# EAGLE design 24V_LM317 (EAGLE 9.5.1)
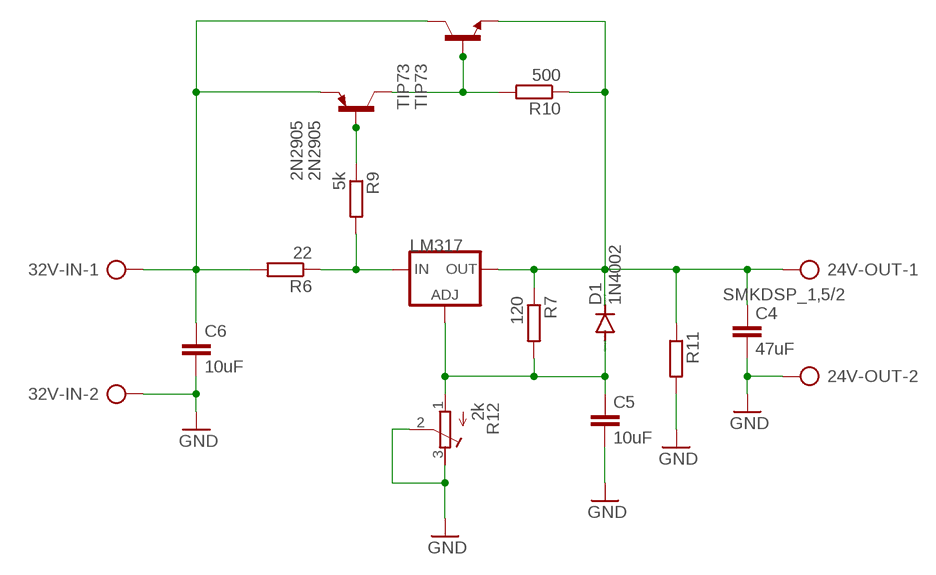
[diagram p0: schematic, sheet 1]

## Parts
2N2905  2N2905  [TO39]
24V-OUT  SMKDSP_1,5/2  [SMKDSP_1,5/2]
32V-IN  SMKDSP_1,5/2  [SMKDSP_1,5/2]
C4  47uF  C-EU025-025X050  [C025-025X050]
C5  10uF  C-EU025-025X050  [C025-025X050]
C6  10uF  C-EU025-025X050  [C025-025X050]
D1  1N4002  1N4004DO-41  [DIOAD860W70L460D235B]
LM317  LM317TS317TS_TO220  [TO220V]
R6  22  R-EU_0204/7  [0204/7]
R7  120  R-EU_0204/7  [0204/7]
R9  5k  R-EU_0204/7  [0204/7]
R10  500  R-EU_0204/7  [0204/7]
R11  R-EU_0204/7  [0204/7]
R12  2k  R-TRIMM64W  [RTRIM64W]
TIP73  TIP73  2N1613  [TO5]

## Nets
24V: 24V-OUT.1 C4.1 D1.1(C) LM317.2(OUT) R7.1 R10.1 R11.1 TIP73.1(E)
GND: 24V-OUT.2 32V-IN.2 C4.2 C5.2 C6.2 R11.2 R12.2(S) R12.3(E)
N$5: LM317.3(IN) R6.1 R9.2
N$6: 2N2905.2(B) R9.1
N$7: 2N2905.3(C) R10.2 TIP73.2(B)
N$8: 2N2905.1(E) 32V-IN.1 C6.1 R6.2 TIP73.3(C)
N$9: C5.1 D1.2(A) LM317.1(ADJ) R7.2 R12.1(A)

## Library data of the parts
2N2905 = transistor-pnp:2N2905*: PNP Transistror
24V-OUT 32V-IN = con-phoenix-smkdsp:SMKDSP_1,5/2: Printklemme, Nennstrom: 17,5 A, Bemessungsspannung: 250 V, Raster: 5,0 mm Source: http://eshop.phoenixcontact.de .. 1733415.pdf; MF: FARNELL; MPN: 1733570; OC_FARNELL: 3041244; OC_NEWARK: 69C8588
C4-C6 = rcl:C-EU: CAPACITOR, European symbol; SPICEPREFIX: C
D1 = diode_MOD:1N4004: DIODE general purpose rectifier, 1 A
LM317 = v-reg:LM317TS: VOLTAGE REGULATOR
R6 R7 R9-R11 = rcl:R-EU_: RESISTOR, European symbol; SPICEPREFIX: R
R12 = rcl:R-TRIMM: Trimm resistor; SPICEMODEL: X; SPICEPREFIXL: POT
TIP73 = transistor:2N1613: NPN TRANSISTOR

## Board
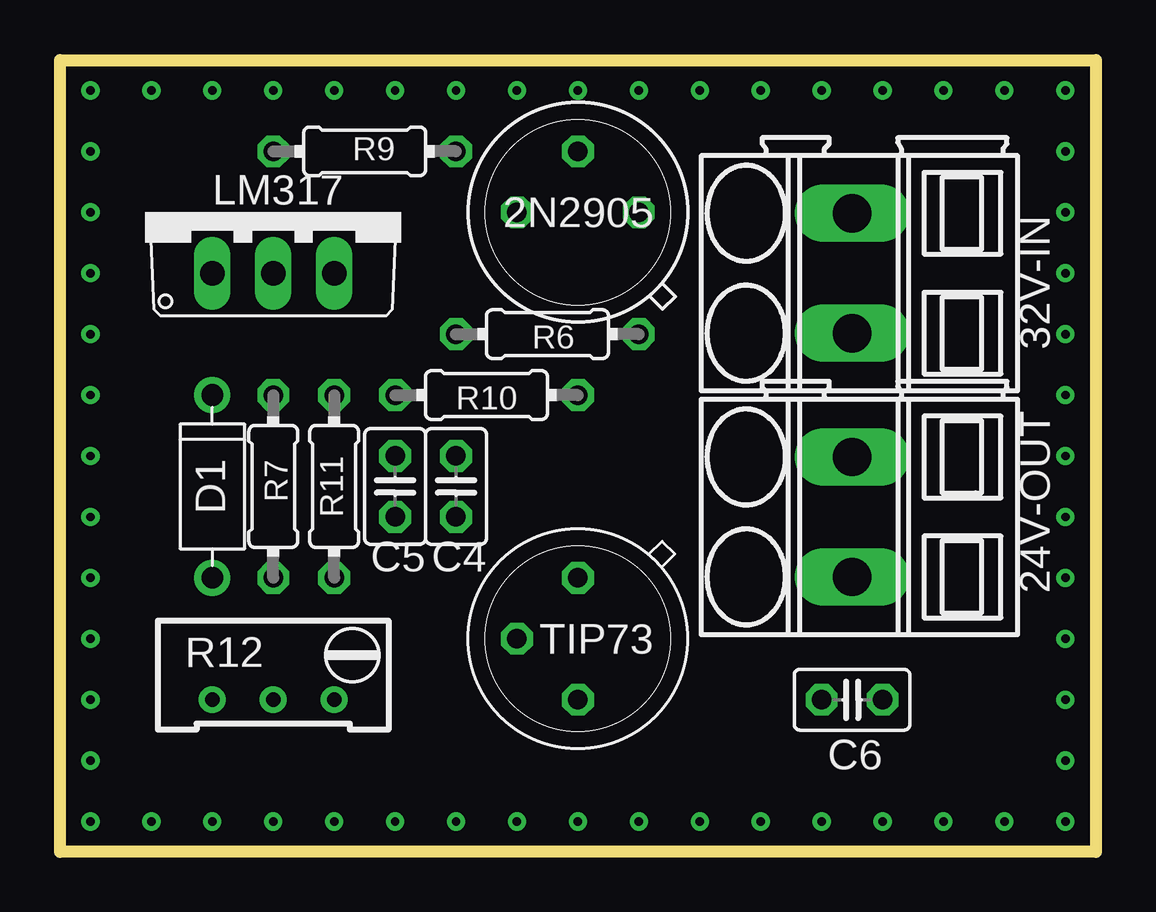
[diagram p1: board, top side]
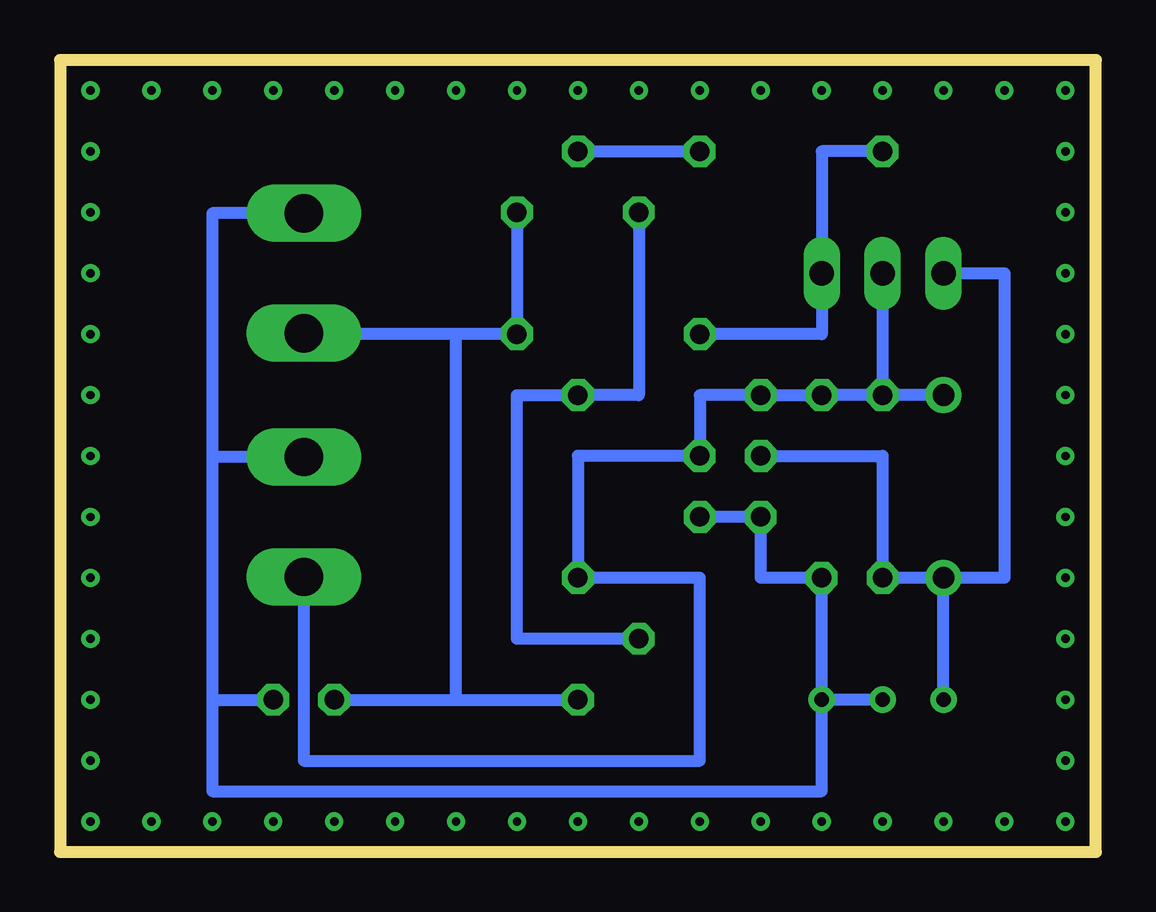
[diagram p2: board, bottom side, seen from below]

Size 43.18 x 33.02 mm. Coordinates in mm from the lower left corner, seen from the top.
Outline: 0,33.02 43.18,33.02 43.18,0 0,0 0,33.02
Copper layers (1*16): Top 0.035mm / dielectric 1.5mm / Bottom 0.035mm
Design rules "default": minimum track width 6mil, minimum drill 0.35mm, track to track 6mil, track to pad 6mil, pad to pad 6mil, via to via 6mil, smd to smd 6mil, copper to edge 40mil, drill to drill 6mil, minimum pad ring 10mil, minimum via ring 8mil, stop-mask expansion 4mil, vias tented up to drill 0mil, thermal gap 10mil

### Footprints (pad centres in the part's own frame; a part is rotated, then mirrored left to right if it is on the bottom)
TO39 = drill 0.813 octagon: 1 0,-2.54; 2 2.54,0; 3 0,2.54
SMKDSP_1,5/2 = drill 1.6 pad 1.8 long: 1 -2.5,0; 2 2.5,0
C025-025X050 = drill 0.813 octagon: 1 -1.27,0; 2 1.27,0
DIOAD860W70L460D235B = drill 0.9 pad 1.5: 1 -3.81,0; 2 3.81,0
TO220V = drill 1.016 long: 1 -2.54,-2.54; 2 0,-2.54; 3 2.54,-2.54
0204/7 = drill 0.813 octagon: 1 -3.81,0; 2 3.81,0
RTRIM64W = drill 0.61: 1 1.27,-2.54; 2 1.27,0; 3 1.27,2.54
TO5 = drill 0.813 octagon: 1 0,-2.54; 2 2.54,0; 3 0,2.54

### Placement (x,y rotation side)
2N2905  21.59,26.67 90 top
24V-OUT  33.02,13.97 90 top
32V-IN  33.02,24.13 90 top
C4  16.51,15.24 270 top
C5  13.97,15.24 270 top
C6  33.02,6.35 0 top
D1  6.35,15.24 270 top
LM317  8.89,26.67 0 top
R6  20.32,21.59 0 top
R7  8.89,15.24 270 top
R9  12.7,29.21 180 top
R10  17.78,19.05 0 top
R11  11.43,15.24 270 top
R12  8.89,7.62 270 top
TIP73  21.59,8.89 180 top

### Tracks (layer width: path | path; a pad name or v marks a point on that pad's centre or on a via)
24V
  Bottom 0.508: R7.1 R11.1 R10.1 16.51,19.05 C4.1 21.59,16.51 TIP73.1 16.51,11.43 16.51,3.81 33.02,3.81 24V-OUT.1 | LM317.2 R7.1 | D1.1 R7.1
GND
  Bottom 0.508: C4.2 C5.2 13.97,11.43 R11.2 R12.3 | R12.2 R12.3 | 32V-IN.2 36.83,26.63 36.83,16.47 | 24V-OUT.2 36.83,16.47 | 36.83,16.47 36.83,6.35 | 36.83,6.35 C6.2 | 36.83,6.35 36.83,2.54 11.43,2.54 R12.3
N$1  (via drill 0.35)
  other vias: 1.27,24.13
N$2  (via drill 0.35)
  other vias: 1.27,26.67
N$3  (via drill 0.35)
  other vias: 1.27,29.21
N$4  (via drill 0.35)
  other vias: 1.27,31.75
N$5
  Bottom 0.508: R9.2 11.43,29.21 LM317.3 11.43,21.59 R6.1
N$6
  Bottom 0.508: 2N2905.2 R9.1
N$7
  Bottom 0.508: TIP73.2 24.13,8.89 24.13,19.05 R10.2 19.05,19.05 2N2905.3
N$8
  Bottom 0.508: C6.1 26.67,6.35 | 26.67,6.35 TIP73.3 | 2N2905.1 R6.2 26.67,21.59 | 26.67,21.59 33.02,21.59 32V-IN.1 | 26.67,6.35 26.67,21.59
N$9
  Bottom 0.508: D1.2 R7.2 8.89,16.51 C5.1 | R12.1 D1.2 | LM317.1 3.81,24.13 3.81,11.43 D1.2
N$10  (via drill 0.35)
  other vias: 3.81,31.75
N$11  (via drill 0.35)
  other vias: 6.35,31.75
N$12  (via drill 0.35)
  other vias: 8.89,31.75
N$13  (via drill 0.35)
  other vias: 11.43,31.75
N$14  (via drill 0.35)
  other vias: 13.97,31.75
N$15  (via drill 0.35)
  other vias: 16.51,31.75
N$16  (via drill 0.35)
  other vias: 19.05,31.75
N$17  (via drill 0.35)
  other vias: 21.59,31.75
N$18  (via drill 0.35)
  other vias: 24.13,31.75
N$19  (via drill 0.35)
  other vias: 26.67,31.75
N$20  (via drill 0.35)
  other vias: 29.21,31.75
N$21  (via drill 0.35)
  other vias: 31.75,31.75
N$22  (via drill 0.35)
  other vias: 34.29,31.75
N$23  (via drill 0.35)
  other vias: 36.83,31.75
N$24  (via drill 0.35)
  other vias: 39.37,31.75
N$25  (via drill 0.35)
  other vias: 41.91,31.75
N$26  (via drill 0.35)
  other vias: 41.91,29.21
N$27  (via drill 0.35)
  other vias: 41.91,26.67
N$28  (via drill 0.35)
  other vias: 41.91,24.13
N$29  (via drill 0.35)
  other vias: 41.91,21.59
N$30  (via drill 0.35)
  other vias: 41.91,19.05
N$31  (via drill 0.35)
  other vias: 41.91,16.51
N$32  (via drill 0.35)
  other vias: 41.91,13.97
N$33  (via drill 0.35)
  other vias: 41.91,11.43
N$34  (via drill 0.35)
  other vias: 41.91,8.89
N$35  (via drill 0.35)
  other vias: 41.91,6.35
N$36  (via drill 0.35)
  other vias: 41.91,3.81
N$37  (via drill 0.35)
  other vias: 41.91,1.27
N$38  (via drill 0.35)
  other vias: 39.37,1.27
N$39  (via drill 0.35)
  other vias: 36.83,1.27
N$40  (via drill 0.35)
  other vias: 34.29,1.27
N$41  (via drill 0.35)
  other vias: 31.75,1.27
N$42  (via drill 0.35)
  other vias: 29.21,1.27
N$43  (via drill 0.35)
  other vias: 26.67,1.27
N$44  (via drill 0.35)
  other vias: 24.13,1.27
N$45  (via drill 0.35)
  other vias: 21.59,1.27
N$46  (via drill 0.35)
  other vias: 19.05,1.27
N$47  (via drill 0.35)
  other vias: 16.51,1.27
N$48  (via drill 0.35)
  other vias: 13.97,1.27
N$49  (via drill 0.35)
  other vias: 11.43,1.27
N$50  (via drill 0.35)
  other vias: 8.89,1.27
N$51  (via drill 0.35)
  other vias: 6.35,1.27
N$52  (via drill 0.35)
  other vias: 3.81,1.27
N$53  (via drill 0.35)
  other vias: 1.27,1.27
N$54  (via drill 0.35)
  other vias: 1.27,3.81
N$55  (via drill 0.35)
  other vias: 1.27,6.35
N$56  (via drill 0.35)
  other vias: 1.27,8.89
N$57  (via drill 0.35)
  other vias: 1.27,11.43
N$58  (via drill 0.35)
  other vias: 1.27,13.97
N$59  (via drill 0.35)
  other vias: 1.27,16.51
N$60  (via drill 0.35)
  other vias: 1.27,19.05
N$61  (via drill 0.35)
  other vias: 1.27,21.59